# Altium project LED_FADER.PrjPcb
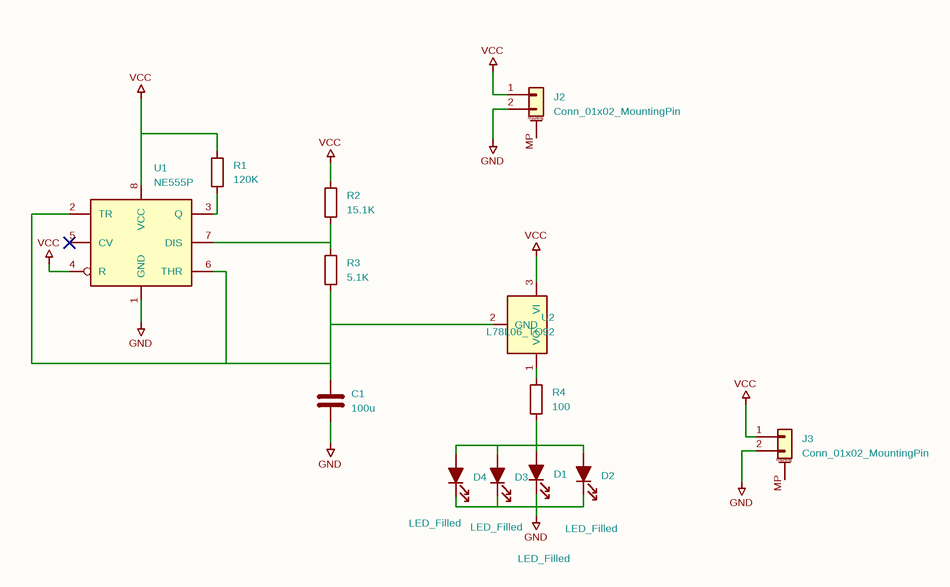
[diagram p0: LED_FADER.SchDoc]
1 sheet, 13 parts. Net scope: global (net labels, ports and power ports of the same name join across sheets).
Board files: LED_FADER.PcbDoc, LED_FADER(1).PcbDoc

## Sheet LED_FADER.SchDoc
size 297 x 209 mm

### Parts
C1  100u  [CP_Radial_D5.0mm_P2.50mm]
D1  LED_Filled  [LED_D3.0mm]
D2  LED_Filled  [LED_D3.0mm]
D3  LED_Filled  [LED_D3.0mm]
D4  LED_Filled  [LED_D3.0mm]
J2  Conn_01x02_MountingPin  [PinHeader_1x02_P2.54mm_Vertical]
J3  Conn_01x02_MountingPin  [PinHeader_1x02_P2.54mm_Vertical]
R1  120K  [R_Axial_DIN0207_L6.3mm_D2.5mm_P7.62mm_Horizontal]
R2  15.1K  [R_Axial_DIN0207_L6.3mm_D2.5mm_P7.62mm_Horizontal]
R3  5.1K  [R_Axial_DIN0207_L6.3mm_D2.5mm_P7.62mm_Horizontal]
R4  100  [R_Axial_DIN0207_L6.3mm_D2.5mm_P7.62mm_Horizontal]
U1  NE555P  [DIP-8_W7.62mm]
U2  L78L06_TO92  [TO-92L_Inline]

### Nets
GND: C1.2 D1.1(K) D2.1(K) D3.1(K) D4.1(K) J2.2(Pin_2) J3.2(Pin_2) U1.1(GND)
VCC: J2.1(Pin_1) J3.1(Pin_1) R1.1 R2.1 U1.4(R) U1.8(VCC) U2.3(VI)
NetC1_1: C1.1 R3.2 U1.2(TR) U1.6(THR) U2.2(GND)
NetD1_2: D1.2(A) D2.2(A) D3.2(A) D4.2(A) R4.2
NetR1_2: R1.2 U1.3(Q)
NetR2_2: R2.2 R3.1 U1.7(DIS)
NetR4_1: R4.1 U2.1(VO)

Not connected (* = marked no-connect by the designer): J2 MP(MountPin); J3 MP(MountPin); U1 5(CV)*

### Notes on the sheet
- 1
- 2
- 3
- 4
- 5
- 6
- A
- B
- C
- D
- Title:
- File: LED_FADER.kicad_sch
- Sheet: /
- KiCad E.D.A.  kicad (5.1.4)-1
- Size: A4
- Date:
- Rev:
- Id: 1/1
- (in symbol Conn_01x02_MountingPin) Mounting

### Library data of the parts
C1 = C: Description: Unpolarized capacitor; Value: 100u; Footprint: Capacitor_THT:CP_Radial_D5.0mm_P2.50mm
D1-D4 = LED_Filled: Description: Light emitting diode, filled shape; Value: LED_Filled; Footprint: LED_THT:LED_D3.0mm
J2 J3 = Conn_01x02_MountingPin: Description: Generic connectable mounting pin connector, single row, 01x02, script generated (kicad-library-utils/schlib/autogen/connector/); Value: Conn_01x02_MountingPin; Footprint: Connector_PinHeader_2.54mm:PinHeader_1x02_P2.54mm_Vertical
R1-R4 = R: Description: Resistor; Footprint: Resistor_THT:R_Axial_DIN0207_L6.3mm_D2.5mm_P7.62mm_Horizontal
  R1: Value: 120K
  R2: Value: 15.1K
  R3: Value: 5.1K
  R4: Value: 100
U1 = NE555P: Description: Precision Timers, 555 compatible,  PDIP-8; Value: NE555P; Footprint: Package_DIP:DIP-8_W7.62mm
U2 = L78L06_TO92: Description: Positive 100mA 30V Linear Regulator, Fixed Output 6V, TO-92; Value: L78L06_TO92; Footprint: Package_TO_SOT_THT:TO-92L_Inline